# Altium project MusicSpectrumAnalyzer.PrjPcb
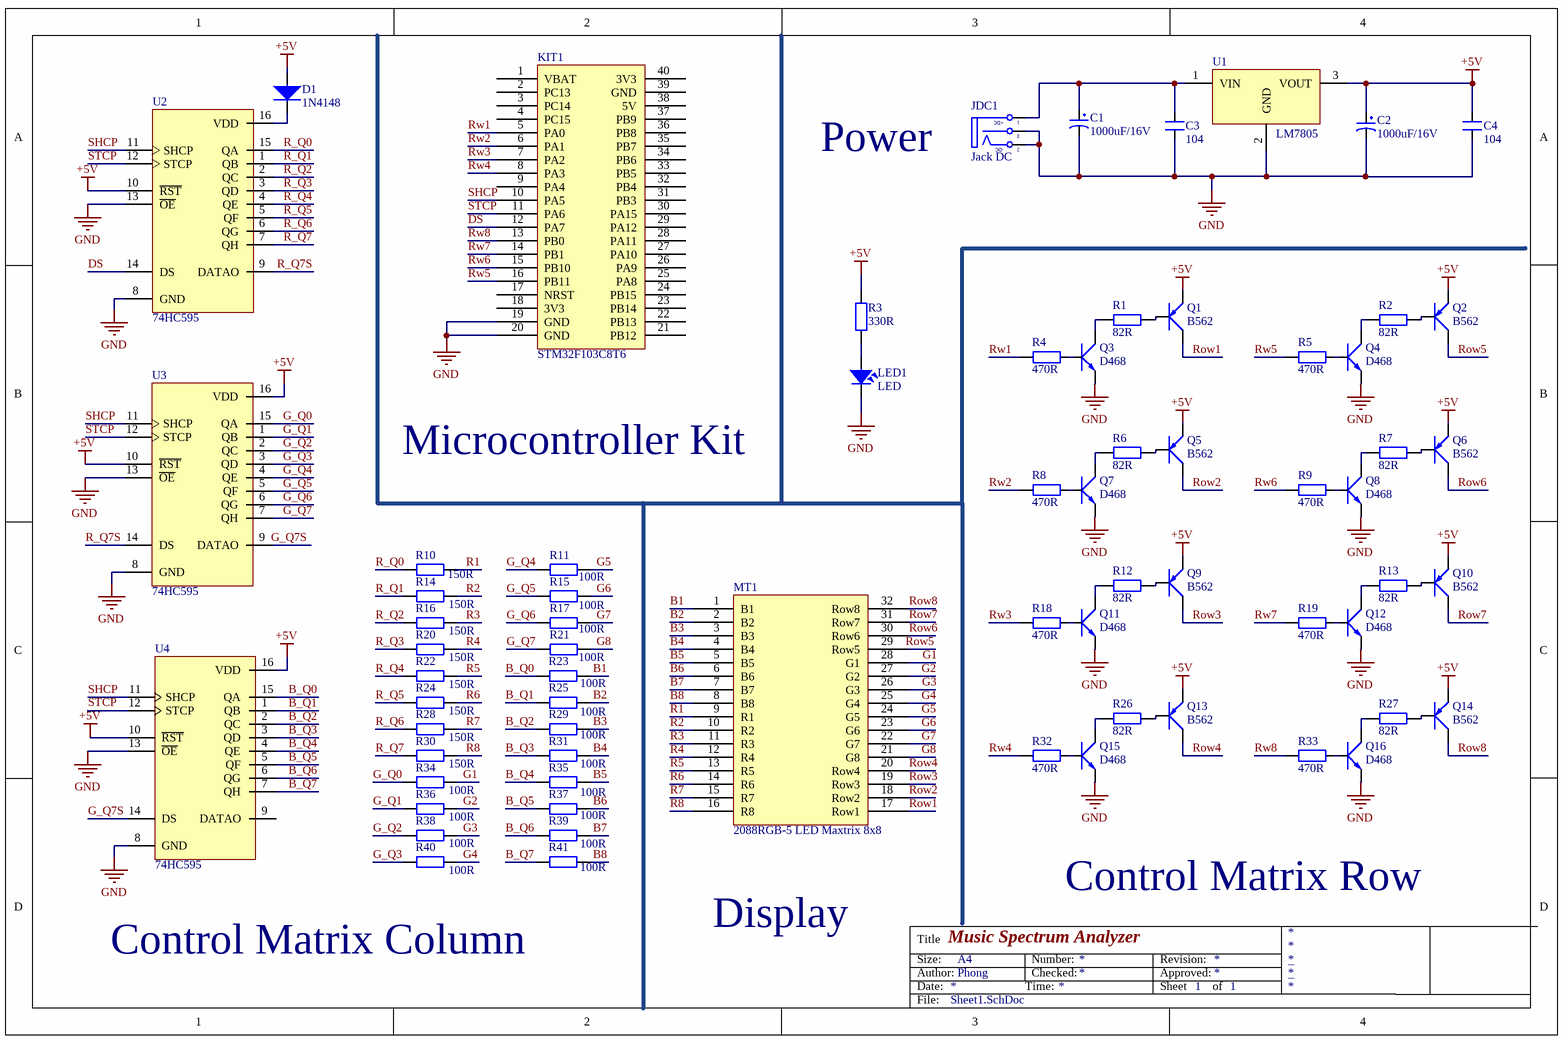
[diagram p0: Sheet1.SchDoc]
1 sheet, 70 parts. Net scope: global (net labels, ports and power ports of the same name join across sheets).
Board file: PCB1.PcbDoc

## Sheet Sheet1.SchDoc: Music Spectrum Analyzer
size A4; Author: Phong; DrawnBy: Phong; SheetNumber: 1; SheetTotal: 1; ImagePath: E:\WorkSpace\Python\MusicSpectrumAnalyzer\images\equalizer.png

### Parts
C1  1000uF/16V  [CP1.5/3.4]
C2  1000uF/16V  [CP1.5/3.4]
C3  104  [CN2]
C4  104  [CN2]
D1  1N4148  [DO-35]
JDC1  Jack DC  [DC-IN]
KIT1  STM32F103C8T6  [STM32F103C8T6 BLUE PILL DEVELOPMENT BOARD]
LED1  LED  [LED-3]
MT1  2088RGB-5 LED Maxtrix 8x8  [LED 8x8 RGB]
Q1  B562  [QTO-92]
Q2  B562  [QTO-92]
Q3  D468  [QTO-92]
Q4  D468  [QTO-92]
Q5  B562  [QTO-92]
Q6  B562  [QTO-92]
Q7  D468  [QTO-92]
Q8  D468  [QTO-92]
Q9  B562  [QTO-92]
Q10  B562  [QTO-92]
Q11  D468  [QTO-92]
Q12  D468  [QTO-92]
Q13  B562  [QTO-92]
Q14  B562  [QTO-92]
Q15  D468  [QTO-92]
Q16  D468  [QTO-92]
R1  82R  [RES-1/4W-SMALL]
R2  82R  [RES-1/4W-SMALL]
R3  330R  [RES-1/4W-SMALL]
R4  470R  [RES-1/4W-SMALL]
R5  470R  [RES-1/4W-SMALL]
R6  82R  [RES-1/4W-SMALL]
R7  82R  [RES-1/4W-SMALL]
R8  470R  [RES-1/4W-SMALL]
R9  470R  [RES-1/4W-SMALL]
R10  150R  [RES-1/4W-SMALL]
R11  100R  [RES-1/4W-SMALL]
R12  82R  [RES-1/4W-SMALL]
R13  82R  [RES-1/4W-SMALL]
R14  150R  [RES-1/4W-SMALL]
R15  100R  [RES-1/4W-SMALL]
R16  150R  [RES-1/4W-SMALL]
R17  100R  [RES-1/4W-SMALL]
R18  470R  [RES-1/4W-SMALL]
R19  470R  [RES-1/4W-SMALL]
R20  150R  [RES-1/4W-SMALL]
R21  100R  [RES-1/4W-SMALL]
R22  150R  [RES-1/4W-SMALL]
R23  100R  [RES-1/4W-SMALL]
R24  150R  [RES-1/4W-SMALL]
R25  100R  [RES-1/4W-SMALL]
R26  82R  [RES-1/4W-SMALL]
R27  82R  [RES-1/4W-SMALL]
R28  150R  [RES-1/4W-SMALL]
R29  100R  [RES-1/4W-SMALL]
R30  150R  [RES-1/4W-SMALL]
R31  100R  [RES-1/4W-SMALL]
R32  470R  [RES-1/4W-SMALL]
R33  470R  [RES-1/4W-SMALL]
R34  100R  [RES-1/4W-SMALL]
R35  100R  [RES-1/4W-SMALL]
R36  100R  [RES-1/4W-SMALL]
R37  100R  [RES-1/4W-SMALL]
R38  100R  [RES-1/4W-SMALL]
R39  100R  [RES-1/4W-SMALL]
R40  100R  [RES-1/4W-SMALL]
R41  100R  [RES-1/4W-SMALL]
U1  LM7805  [TO220H3]
U2  74HC595  [DIP16]
U3  74HC595  [DIP16]
U4  74HC595  [DIP16]

### Nets
+5V: C2.1 C4.2 D1.1 Q1.1(E) Q2.1(E) Q5.1(E) Q6.1(E) Q9.1(E) Q10.1(E) Q13.1(E) Q14.1(E) R3.2 U1.3(VOUT) U2.10(~{RST}) U3.10(~{RST}) U3.16(VDD) U4.10(~{RST}) U4.16(VDD)
GND: C1.2 C2.2 C3.1 C4.1 JDC1.2(TN) JDC1.3(S) KIT1.19(GND) KIT1.20(GND) LED1.2 Q3.1(E) Q4.1(E) Q7.1(E) Q8.1(E) Q11.1(E) Q12.1(E) Q15.1(E) Q16.1(E) U1.2(GND) U2.8(GND) U2.13(~{OE}) U3.8(GND) U3.13(~{OE}) U4.8(GND) U4.13(~{OE})
B1: MT1.1(B1) R23.2
B2: MT1.2(B2) R25.2
B3: MT1.3(B3) R29.2
B4: MT1.4(B4) R31.2
B5: MT1.5(B5) R35.2
B6: MT1.6(B6) R37.2
B7: MT1.7(B7) R39.2
B8: MT1.8(B8) R41.2
B_Q0: R23.1 U4.15(QA)
B_Q1: R25.1 U4.1(QB)
B_Q2: R29.1 U4.2(QC)
B_Q3: R31.1 U4.3(QD)
B_Q4: R35.1 U4.4(QE)
B_Q5: R37.1 U4.5(QF)
B_Q6: R39.1 U4.6(QG)
B_Q7: R41.1 U4.7(QH)
DS: KIT1.12(PA7) U2.14(DS)
G1: MT1.28(G1) R34.2
G2: MT1.27(G2) R36.2
G3: MT1.26(G3) R38.2
G4: MT1.25(G4) R40.2
G5: MT1.24(G5) R11.2
G6: MT1.23(G6) R15.2
G7: MT1.22(G7) R17.2
G8: MT1.21(G8) R21.2
G_Q0: R34.1 U3.15(QA)
G_Q1: R36.1 U3.1(QB)
G_Q2: R38.1 U3.2(QC)
G_Q3: R40.1 U3.3(QD)
G_Q4: R11.1 U3.4(QE)
G_Q5: R15.1 U3.5(QF)
G_Q6: R17.1 U3.6(QG)
G_Q7: R21.1 U3.7(QH)
G_Q7S: U3.9(DATAO) U4.14(DS)
R1: MT1.9(R1) R10.2
R2: MT1.10(R2) R14.2
R3: MT1.11(R3) R16.2
R4: MT1.12(R4) R20.2
R5: MT1.13(R5) R22.2
R6: MT1.14(R6) R24.2
R7: MT1.15(R7) R28.2
R8: MT1.16(R8) R30.2
R_Q0: R10.1 U2.15(QA)
R_Q1: R14.1 U2.1(QB)
R_Q2: R16.1 U2.2(QC)
R_Q3: R20.1 U2.3(QD)
R_Q4: R22.1 U2.4(QE)
R_Q5: R24.1 U2.5(QF)
R_Q6: R28.1 U2.6(QG)
R_Q7: R30.1 U2.7(QH)
R_Q7S: U2.9(DATAO) U3.14(DS)
Row1: MT1.17(Row1) Q1.2(C)
Row2: MT1.18(Row2) Q5.2(C)
Row3: MT1.19(Row3) Q9.2(C)
Row4: MT1.20(Row4) Q13.2(C)
Row5: MT1.29(Row5) Q2.2(C)
Row6: MT1.30(Row6) Q6.2(C)
Row7: MT1.31(Row7) Q10.2(C)
Row8: MT1.32(Row8) Q14.2(C)
Rw1: KIT1.5(PA0) R4.1
Rw2: KIT1.6(PA1) R8.1
Rw3: KIT1.7(PA2) R18.1
Rw4: KIT1.8(PA3) R32.1
Rw5: KIT1.16(PB11) R5.1
Rw6: KIT1.15(PB10) R9.1
Rw7: KIT1.14(PB1) R19.1
Rw8: KIT1.13(PB0) R33.1
SHCP: KIT1.10(PA5) U2.11(SHCP) U3.11(SHCP) U4.11(SHCP)
STCP: KIT1.11(PA6) U2.12(STCP) U3.12(STCP) U4.12(STCP)
NetC1_1: C1.1 C3.2 JDC1.1(T) U1.1(VIN)
NetD1_2: D1.2 U2.16(VDD)
NetLED1_1: LED1.1 R3.1
NetQ1_3: Q1.3(B) R1.2
NetQ2_3: Q2.3(B) R2.2
NetQ3_2: Q3.2(C) R1.1
NetQ3_3: Q3.3(B) R4.2
NetQ4_2: Q4.2(C) R2.1
NetQ4_3: Q4.3(B) R5.2
NetQ5_3: Q5.3(B) R6.2
NetQ6_3: Q6.3(B) R7.2
NetQ7_2: Q7.2(C) R6.1
NetQ7_3: Q7.3(B) R8.2
NetQ8_2: Q8.2(C) R7.1
NetQ8_3: Q8.3(B) R9.2
NetQ9_3: Q9.3(B) R12.2
NetQ10_3: Q10.3(B) R13.2
NetQ11_2: Q11.2(C) R12.1
NetQ11_3: Q11.3(B) R18.2
NetQ12_2: Q12.2(C) R13.1
NetQ12_3: Q12.3(B) R19.2
NetQ13_3: Q13.3(B) R26.2
NetQ14_3: Q14.3(B) R27.2
NetQ15_2: Q15.2(C) R26.1
NetQ15_3: Q15.3(B) R32.2
NetQ16_2: Q16.2(C) R27.1
NetQ16_3: Q16.3(B) R33.2

Not connected (* = marked no-connect by the designer): KIT1 1(VBAT) 2(PC13) 3(PC14) 4(PC15) 9(PA4) 17(NRST) 18(3V3) 21(PB12) 22(PB13) 23(PB14) 24(PB15) 25(PA8) 26(PA9) 27(PA10) 28(PA11) 29(PA12) 30(PA15) 31(PB3) 32(PB4) 33(PB5) 34(PB6) 35(PB7) 36(PB8) 37(PB9) 38(5V) 39(GND) 40(3V3); U4 9(DATAO)

### Notes on the sheet
- Power
- Microcontroller Kit
- Display
- Control Matrix Row
- Control Matrix Column
- Title
- Size:
- Date:
- Author:
- A4
- Time:
- Number:
- Checked:
- Revision:
- Sheet
- Approved:
- of
- File:
- (in symbol DCIN) +DC; -DC

### Library data of the parts
C1 C2 = CP4: Cap 1000uF/16V - 220uF/50V; Description 5: 4,7uF>10uF/250V_3,3uF>10uF/400V - 2,2uF>4,7uF/450V; Description 1: 2200uF-3300uF/6,3V - 1000uF-2200uF/10V; Description 2: 1000uF/16V - 470uF => 1000uF/25V - 100uF/100V; Description 3: 330uF>470uF/35V_220uF>470uF/50V_10uF>22uF/250V; Description 4: 220uF => 330uF/63V - 10uF =>33uF/160 - 200V; Value: 1000uF/16V
C3 C4 = CN2: Cap np 104 => 105pF; Value: 0.1uF
D1 = Diode Standard: Part Number: LED 3 ly Single Colour; Pricing: *
JDC1 = DCIN: Jac DC input; Value: Jac DC
KIT1 = Kit STM32F103C8T6 blue pill: STM32F103C8T6 Blue Pill Development Board
LED1 = LED: LED Single colour Green and Red; Value: LED 3 ly Single Colour
MT1 = LED 8x8 RGB: 32 pins
Q1 Q2 Q5 Q6 Q9 Q10 Q13 Q14 = PNP_ECB: P 600mW, ECB; Value: A1015
Q3 Q4 Q7 Q8 Q11 Q12 Q15 Q16 = NPN_ECB: P 600mW, ECB; Value: C1815
R1-R41 = RES 1/4W: Resistor 1/4W; Value: R1/4W - 1K
U1 = LM7815
U2-U4 = 74HC595: 8-Bit Serial-Input/Serial or Prallel-Output Shift Register with Latched 3-State Outputs; Published: 15-Apr-2002; DatasheetVersion: Mar-2000; PackageVersion: Apr-2000; PackageReference: 648-08; Publisher: Altium Limited; PackageDescription: DIP; 16 Leads; Row Spacing 7.62 mm; Pitch 2.54 mm; Code_JEDEC: MS-001-BB; ComponentLink1Description: Manufacturer Link; ComponentLink1URL: http://www.onsemi.com/; ComponentLink2Description: Datasheet; ComponentLink2URL: http://www.onsemi.com/pub/Collateral/MC74HC595A-D.PDF